# EAGLE design module_HC05 (EAGLE 8.4.0)
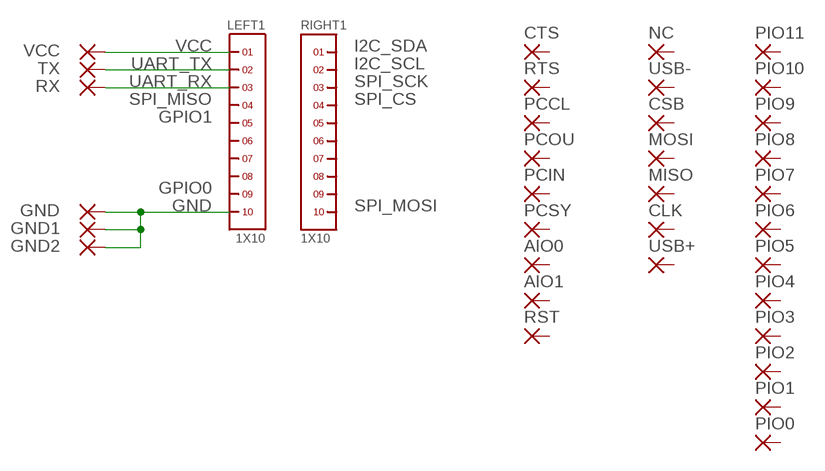
[diagram p0: schematic, sheet 1]

## Parts
AIO0  SMD1  [SMD0,65-1,27]
AIO1  SMD1  [SMD0,65-1,27]
CLK  SMD1  [SMD0,65-1,27]
CSB  SMD1  [SMD0,65-1,27]
CTS  SMD1  [SMD0,65-1,27]
GND  SMD1  [SMD0,65-1,27]
GND1  SMD1  [SMD0,65-1,27]
GND2  SMD1  [SMD0,65-1,27]
LEFT1  1X10  [1X10]
MISO  SMD1  [SMD0,65-1,27]
MOSI  SMD1  [SMD0,65-1,27]
NC  SMD1  [SMD0,65-1,27]
PCCL  SMD1  [SMD0,65-1,27]
PCIN  SMD1  [SMD0,65-1,27]
PCOU  SMD1  [SMD0,65-1,27]
PCSY  SMD1  [SMD0,65-1,27]
PIO0  SMD1  [SMD0,65-1,27]
PIO1  SMD1  [SMD0,65-1,27]
PIO2  SMD1  [SMD0,65-1,27]
PIO3  SMD1  [SMD0,65-1,27]
PIO4  SMD1  [SMD0,65-1,27]
PIO5  SMD1  [SMD0,65-1,27]
PIO6  SMD1  [SMD0,65-1,27]
PIO7  SMD1  [SMD0,65-1,27]
PIO8  SMD1  [SMD0,65-1,27]
PIO9  SMD1  [SMD0,65-1,27]
PIO10  SMD1  [SMD0,65-1,27]
PIO11  SMD1  [SMD0,65-1,27]
RIGHT1  1X10  [1X10]
RST  SMD1  [SMD0,65-1,27]
RTS  SMD1  [SMD0,65-1,27]
RX  SMD1  [SMD0,65-1,27]
TX  SMD1  [SMD0,65-1,27]
USB+  SMD1  [SMD0,65-1,27]
USB-  SMD1  [SMD0,65-1,27]
VCC  SMD1  [SMD0,65-1,27]

## Nets
GND: GND1.1(P) GND2.1(P) GND.1(P) LEFT1.10
UART_RX: LEFT1.3 RX.1(P)
UART_TX: LEFT1.2 TX.1(P)
VCC: LEFT1.1 VCC.1(P)
Unconnected: AIO0.1(P) AIO1.1(P) CLK.1(P) CSB.1(P) CTS.1(P) LEFT1.4 LEFT1.5 LEFT1.6 LEFT1.7 LEFT1.8 LEFT1.9 MISO.1(P) MOSI.1(P) NC.1(P) PCCL.1(P) PCIN.1(P) PCOU.1(P) PCSY.1(P) PIO0.1(P) PIO1.1(P) PIO2.1(P) PIO3.1(P) PIO4.1(P) PIO5.1(P) PIO6.1(P) PIO7.1(P) PIO8.1(P) PIO9.1(P) PIO10.1(P) PIO11.1(P) RIGHT1.1 RIGHT1.2 RIGHT1.3 RIGHT1.4 RIGHT1.5 RIGHT1.6 RIGHT1.7 RIGHT1.8 RIGHT1.9 RIGHT1.10 RST.1(P) RTS.1(P) USB+.1(P) USB-.1(P)

## Notes on the sheet
- VCC | I2C_SDA
- UART_TX | I2C_SCL
- UART_RX | SPI_SCK
- SPI_MISO | SPI_CS
- GPIO1
- GPIO0
- GND | SPI_MOSI

## Library data of the parts
AIO0 AIO1 CLK CSB CTS GND GND1 GND2 MISO MOSI NC PCCL PCIN PCOU PCSY PIO0 PIO1-PIO11 RST RTS RX TX USB+ USB- VCC = wirepad:SMD1: SMD PAD
LEFT1 RIGHT1 = headers(2mm):1X10

## Board
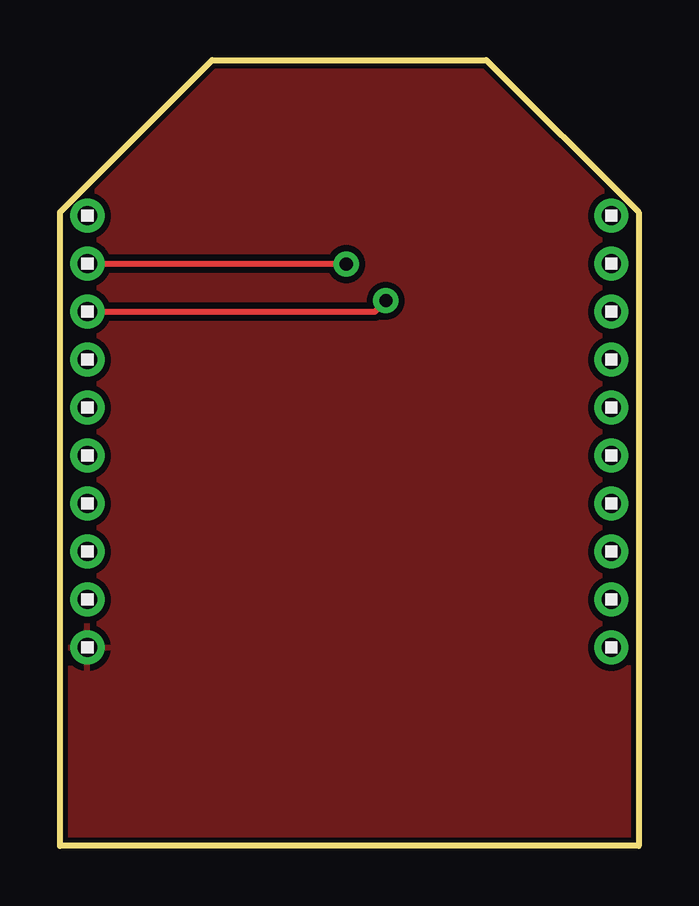
[diagram p1: board, top side]
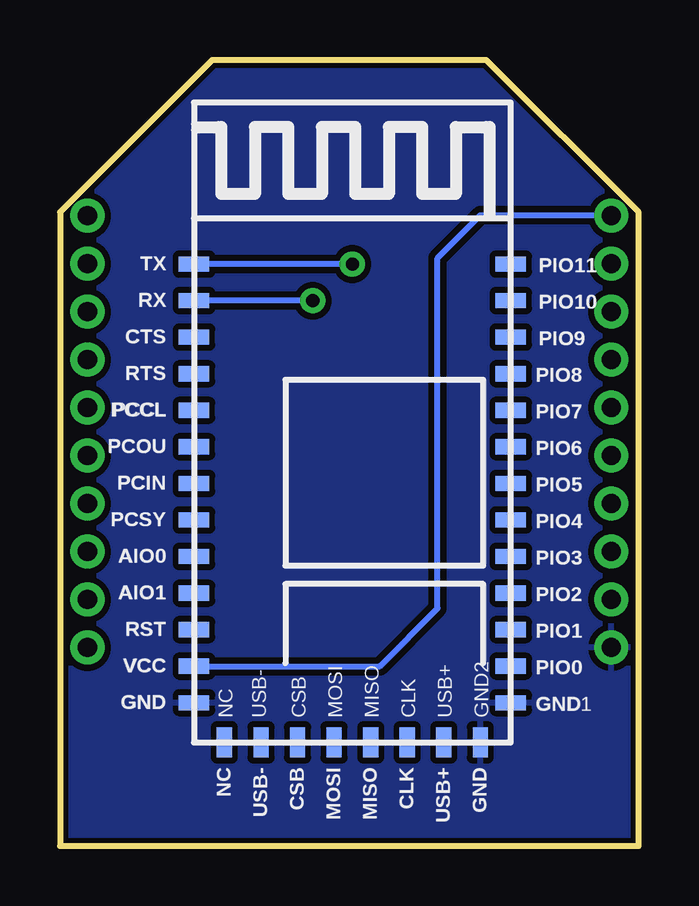
[diagram p2: board, bottom side, seen from below]

Size 24.13 x 32.77 mm. Coordinates in mm from the lower left corner, seen from the top.
Outline: 0,0 0,26.42 6.35,32.77 17.78,32.77 24.13,26.42 24.13,0 0,0
Copper layers (1*16): Top 0.035mm / dielectric 1.5mm / Bottom 0.035mm
Design rules "SparkFun-2-layer-STANDARD": minimum track width 10mil, minimum drill 20mil, track to track 10mil, track to pad 8mil, pad to pad 8mil, via to via 10mil, smd to smd 8mil, copper to edge 8mil, drill to drill 8mil, minimum pad ring 10mil, minimum via ring 10mil, stop-mask expansion 4mil, vias tented up to drill 25mil, thermal gap 10mil

### Footprints (pad centres in the part's own frame; a part is rotated, then mirrored left to right if it is on the bottom)
SMD0,65-1,27 = smd 0.635 x 1.27: 1 0,0
1X10 = drill 0.8 pad 1.422: 1 -9,0; 2 -7,0; 3 -5,0; 4 -3,0; 5 -1,0; 6 1,0; 7 3,0; 8 5,0; 9 7,0; 10 9,0

### Placement (x,y rotation side)
AIO0  18.54,12.06 270 bottom
AIO1  18.54,10.54 270 bottom
CLK  9.65,4.32 180 bottom
CSB  14.22,4.32 180 bottom
CTS  18.54,21.21 90 bottom
GND  18.54,5.97 270 bottom
GND1  5.33,5.97 90 bottom
GND2  6.6,4.32 180 bottom
LEFT1  1.14,17.27 270 top
MISO  11.18,4.32 180 bottom
MOSI  12.7,4.32 180 bottom
NC  17.27,4.32 180 bottom
PCCL  18.54,18.16 90 bottom
PCIN  18.54,15.11 270 bottom
PCOU  18.54,16.64 90 bottom
PCSY  18.54,13.59 270 bottom
PIO0  5.33,7.49 90 bottom
PIO1  5.33,9.02 90 bottom
PIO2  5.33,10.54 90 bottom
PIO3  5.33,12.06 90 bottom
PIO4  5.33,13.59 90 bottom
PIO5  5.33,15.11 90 bottom
PIO6  5.33,16.64 90 bottom
PIO7  5.33,18.16 90 bottom
PIO8  5.33,19.69 90 bottom
PIO9  5.33,21.21 90 bottom
PIO10  5.33,22.73 90 bottom
PIO11  5.33,24.26 90 bottom
RIGHT1  22.99,17.27 270 top
RST  18.54,9.02 270 bottom
RTS  18.54,19.69 90 bottom
RX  18.54,22.73 90 bottom
TX  18.54,24.26 90 bottom
USB+  8.13,4.32 180 bottom
USB-  15.75,4.32 180 bottom
VCC  18.54,7.49 270 bottom

### Tracks (layer width: path | path; a pad name or v marks a point on that pad's centre or on a via)
GND
  pour Top: -0.25,-0.25 24.38,-0.25 24.38,26.54 17.91,33.02 6.22,33.02 -0.25,26.54
  pour Bottom: -0.51,-0.51 24.64,-0.51 24.64,26.67 18.03,33.27 6.1,33.27 -0.51,26.67
UART_RX  (via drill 0.55)
  Top 0.254: LEFT1.3 13.13,22.27 v13.59,22.73
  Bottom 0.254: v13.59,22.73 RX.1
UART_TX  (via drill 0.55)
  Top 0.254: LEFT1.2 11.92,24.27 v11.94,24.26
  Bottom 0.254: v11.94,24.26 TX.1
VCC
  Bottom 0.254: VCC.1 10.79,7.49 8.38,9.91 8.38,24.51 6.6,26.29 1.16,26.29 LEFT1.1

### Text on the board
_bNames: TX | PIO11 | PIO10 | RX | CTS | PIO9 | RTS | PIO8 | PCCL | PIO7 | PCOU | PIO6 | PCIN | PIO5 | PCSY | PIO4 | AIO0 | PIO3 | AIO1 | PIO2 | PIO1 | RST | VCC | PIO0 | GND | GND | GND | USB+ | CLK | MISO | MOSI | CSB | USB- | NC
_tDocu: PWR: / LOG: | 3.3 V / 3.3 V | HC-05